# Altium schematic sheet LVDS_IFC_HVAMP.SchDoc: LVDS
size 420 x 297 mm; EDA_Number: ARTIQ; Projet: Zotino; Author: G.Kasprowicz; CompanyName: WUT ISE; DrawnBy: G.Kasprowicz; Organization: WUT ISE; Address1: PW ISE; Address2: Nowowiejska 15/19 00-665 Warsaw; Address3: gkasprow@gmail.com; DocumentNumber: 3; Revision: 2; SheetNumber: 3; SheetTotal: 5; ModifiedBy: -; CheckedDate: -; Title2: Interface; DivGrp: WUT ISE; Designer: G.Kasprowicz; ModifiedDate: -; ProjectName: Sensor Box
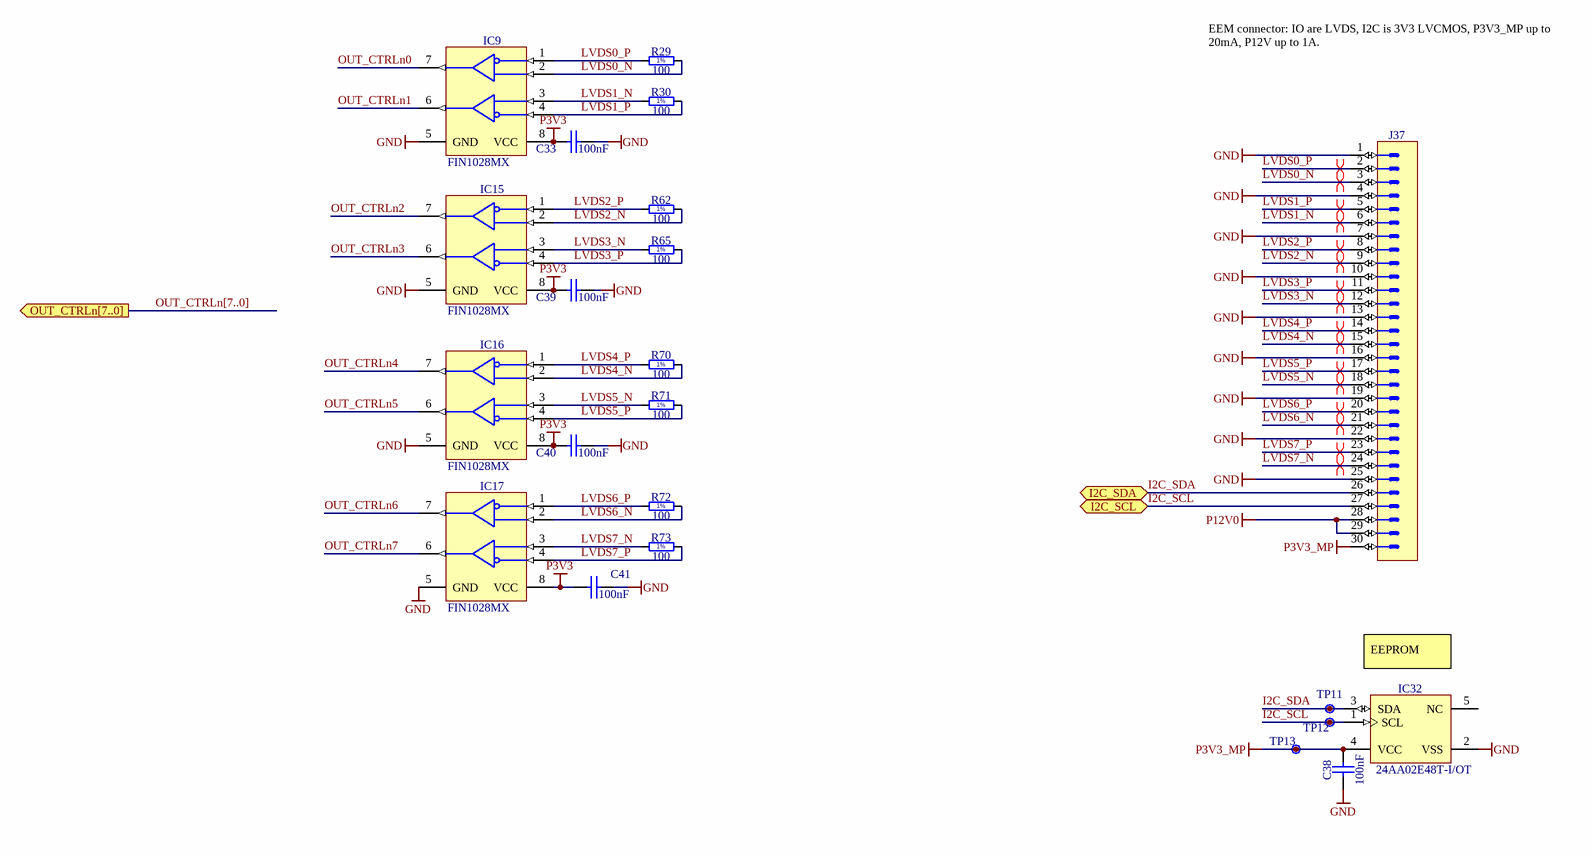
[diagram p0: LVDS_IFC_HVAMP.SchDoc]

## Parts
C33  100nF  [CAPC1005X55N]
C38  100nF  [CAPC1005X55N]
C39  100nF  [CAPC1005X55N]
C40  100nF  [CAPC1005X55N]
C41  100nF  [CAPC1005X55N]
IC9  FIN1028MX  [SOIC127P600X175-8N]
IC15  FIN1028MX  [SOIC127P600X175-8N]
IC16  FIN1028MX  [SOIC127P600X175-8N]
IC17  FIN1028MX  [SOIC127P600X175-8N]
IC32  24AA02E48T-I/OT  [SOT95P280X145-5N]
J37  (no value)  [3M_N2530-6002RB]
R29  100  [RESC1005X40N]
R30  100  [RESC1005X40N]
R62  100  [RESC1005X40N]
R65  100  [RESC1005X40N]
R70  100  [RESC1005X40N]
R71  100  [RESC1005X40N]
R72  100  [RESC1005X40N]
R73  100  [RESC1005X40N]
TP11  Test Point  [TPS127]  (value not drawn)
TP12  Test Point  [TPS127]  (value not drawn)
TP13  Test Point  [TPS127]  (value not drawn)

## Ports
I2C_SCL (bidir), I2C_SDA (bidir), OUT_CTRLn[7..0] (out)

## Nets
GND: C33.1 C38.1 C39.1 C40.1 C41.1 IC9.5(GND) IC15.5(GND) IC16.5(GND) IC17.5(GND) IC32.2(VSS) J37.1 J37.4 J37.7 J37.10 J37.13 J37.16 J37.19 J37.22 J37.25
P3V3: C33.2 C39.2 C40.2 C41.2 IC9.8(VCC) IC15.8(VCC) IC16.8(VCC) IC17.8(VCC)
P3V3_MP: C38.2 IC32.4(VCC) J37.30 TP13.1
P12V0: J37.28 J37.29
I2C_SCL: IC32.1(SCL) J37.27 TP12.1 ; port I2C_SCL
I2C_SDA: IC32.3(SDA) J37.26 TP11.1 ; port I2C_SDA
LVDS0_N: IC9.2(RIN1+) J37.3 R29.2
LVDS0_P: IC9.1(RIN1-) J37.2 R29.1
LVDS1_N: IC9.3(RIN2+) J37.6 R30.1
LVDS1_P: IC9.4(RIN2-) J37.5 R30.2
LVDS2_N: IC15.2(RIN1+) J37.9 R62.2
LVDS2_P: IC15.1(RIN1-) J37.8 R62.1
LVDS3_N: IC15.3(RIN2+) J37.12 R65.1
LVDS3_P: IC15.4(RIN2-) J37.11 R65.2
LVDS4_N: IC16.2(RIN1+) J37.15 R70.2
LVDS4_P: IC16.1(RIN1-) J37.14 R70.1
LVDS5_N: IC16.3(RIN2+) J37.18 R71.1
LVDS5_P: IC16.4(RIN2-) J37.17 R71.2
LVDS6_N: IC17.2(RIN1+) J37.21 R72.2
LVDS6_P: IC17.1(RIN1-) J37.20 R72.1
LVDS7_N: IC17.3(RIN2+) J37.24 R73.1
LVDS7_P: IC17.4(RIN2-) J37.23 R73.2
OUT_CTRLn0: IC9.7(ROUT1)
OUT_CTRLn1: IC9.6(ROUT2)
OUT_CTRLn2: IC15.7(ROUT1)
OUT_CTRLn3: IC15.6(ROUT2)
OUT_CTRLn4: IC16.7(ROUT1)
OUT_CTRLn5: IC16.6(ROUT2)
OUT_CTRLn6: IC17.7(ROUT1)
OUT_CTRLn7: IC17.6(ROUT2)

Not connected (* = marked no-connect by the designer): IC32 5(NC)

## Buses and harness runs
bus OUT_CTRLn[7..0] = port OUT_CTRLn[7..0]

## Layout directives
differential pair: LVDS0_N, LVDS0_P, LVDS1_N, LVDS1_P, LVDS2_N, LVDS2_P, LVDS3_N, LVDS3_P, LVDS4_N, LVDS4_P, LVDS5_N, LVDS5_P, LVDS6_N, LVDS6_P, LVDS7_N, LVDS7_P

## Notes on the sheet
- EEM connector: IO are LVDS, I2C is 3V3 LVCMOS, P3V3_MP up to 20mA, P12V up to 1A.
- EEPROM
- Project/Equipment
- Document
- Designer
- Drawn by
- Check.by
- Copyright WUT ISE 2020.
  This documentation describes Open Hardware and is licensed under the CERN OHL v.1.2. You may redistribute and modify this documentation under the terms of the CERN OHL v.1.2. (http://ohwr.org/CERNOHL). This documentation is distributed WITHOUT ANY EXPRESS OR IMPLIED WARRANTY, INCLUDING OF MERCHANTABILITY, SATISFACTORY QUALITY AND FITNESS FOR A PARTICULAR PURPOSE. Please see the CERN OHL v.1.2 for applicable conditions.
- Contact
- File
- Last Mod.
- Print Date
- Sheet
- Size
- A3
- of
- Rev
- (in symbol R0402_100R_1%_0.0625W_100PPM) 1%

## Library data of the parts
C33 C38-C41 = CC0402_100NF_16V_10%_X5R: Non-polarised capacitor; Part Description: SMD Multilayer Chip Ceramic Capacitor; Manufacturer: GENERIC; Manufacturer1 Part Number: GRM155R61C104KA88D; Voltage: 16V; TC: X5R; Tolerance: ±10%; Part Number: CC0402_100NF_16V_10%_X5R; Component Kind: Standard; Component Type: Standard; Pin Count: 2; Value: 100nF; Status: None; Manufacturer Part Number: CC0402_100NF_16V_10%_X5R; Case: 0402; Mounted: Yes; Socket: No; SMD: Yes; Sense: No; Manufacturer1 Example: MURATA; Manufacturer1 ComponentHeight: 0.55mm; HelpURL: \\cern.ch\dfs\Applications\Altium\Datasheets\CC0402_X5R_MURATA_GRM.pdf; Author: CERN DEM JLC; CreateDate: 10.12.2013; LatestRevisionDate: 10.12.2013
IC9 IC15-IC17 = IFC_FIN1028: 3.3V LVDS 2-Bit High-Speed Differential Reciever; Manufacturer: ON Semiconductor; PressFit: No; Bonding: No; Part Number: FIN1028MX; Component Kind: Standard; Component Type: Standard; Device: FIN1028MX; PackageDescription: SOIC 8, Pitch 1.27mm - Body 4x5mm, IPC Medium Density; Part Description: 3.3V LVDS 2-Bit High-Speed Differential Reciever; Manufacturer Part Number: FIN1028MX; Pin Count: 8; Case: SOIC8; Mounted: Yes; Socket: No; SMD: Yes; Sense: No; ComponentHeight: 0.8mm; Author: GK; HelpURL: \\cern.ch\dfs\Applications\Altium\Datasheets\FIN1101K8X.pdf; CreateDate: 08/11/2016; LatestRevisionDate: 08/11/2016
IC32 = 24AA02E48T-I/OT: 1.7V-5.5V, 2K I2C Serial EEPROM With EUI-48 Node Identity; Manufacturer: MICROCHIP TECHNOLOGY; PressFit: No; Bonding: No; Part Number: 24AA02E48T-I/OT; Component Kind: Standard; Component Type: Standard; Device: 24AA02E48T-I/OT; PackageDescription: SOT, 0.95mm pitch; 5 pin, 1.60mm W X 2.90mm L X 1.45mm H body, IPC Medium Density; Part Description: 1.7V-5.5V, 2K I2C Serial EEPROM With EUI-48 Node Identity; Manufacturer Part Number: 24AA02E48T-I/OT; Pin Count: 5; Case: SOT23-5; Mounted: Yes; Socket: No; SMD: Yes; Sense: No; ComponentHeight: 1.45mm; HelpURL: \\cern.ch\dfs\Applications\Altium\Datasheets\24AA02E48T-I-OT.pdf; Author: CERN DEM MR; CreateDate: 31.03.2016; LatestRevisionDate: 31.03.2016
J37 = 3M_N2530-6002RB: Connector 30 Male; Part Description: 30 Contacts - Straight .100'' x .100'' Low Profile Four-Wall Header, 2500 Series; Manufacturer: 3M; PressFit: No; Part Number: 3M_N2530-6002RB; Component Kind: Standard; Component Type: Standard; Pin Count: 30; Family: Header 30; Mounted: Yes; Socket: No; SMD: No; Sense: No; Status: None; Manufacturer Part Number: N2530-6002RB; ComponentHeight: 10.03mm; HelpURL: \\cern.ch\dfs\Applications\Altium\Datasheets\3M_N2530-6002RB.pdf; Author: CERN DEM JLC; CreateDate: 11.02.2009; LatestRevisionDate: 11.08.2009
R29 R30 R62 R65 R70-R73 = R0402_100R_1%_0.0625W_100PPM: Resistor - 1%; Part Description: General Purpose Thick Film Chip Resistor; Manufacturer: GENERIC; Manufacturer1 Part Number: 232270671001L; TC: ±100ppm/°C; PressFit: No; Part Number: R0402_100R_1%_0.0625W_100PPM; Component Kind: Standard; Component Type: Standard; Pin Count: 2; Value: 100; Status: Not Recommended; Power: 0.0625W; Tolerance: ±1%; Manufacturer Part Number: R0402_100R_1%_0.0625W_100PPM; Case: 0402; Mounted: Yes; Sense: No; Socket: No; SMD: Yes; Manufacturer1 Example: YAGEO PHYCOMP; Manufacturer1 ComponentHeight: 0.4mm; HelpURL: \\cern.ch\dfs\Applications\Altium\Datasheets\R0402_Phycomp_RC0402.pdf; Author: CERN DEM JLC; CreateDate: 03.12.2007; LatestRevisionDate: 17.10.2012
TP11-TP13 = SMD_PAD_1.27X1.27MM: Part Description: 1.27mm x 1.27mm PCB Copper Area (SMD Test Point); Mounted: No; Part Number: SMD_PAD_1.27X1.27MM; Component Kind: Standard (No BOM); Component Type: Standard (No BOM); Pin Count: 1; Family: Test Point; Socket: No; SMD: Yes; Sense: No; Status: None; ComponentHeight: 0mm; HelpURL: Undefined; Author: CERN DEM JLC; CreateDate: 12.01.2008; LatestRevisionDate: 12.01.2008; PackageDescription: 1.27mm x 1.27mm PCB Copper Area (SMD Test Point)